# Altium project lab_1.PrjPcb
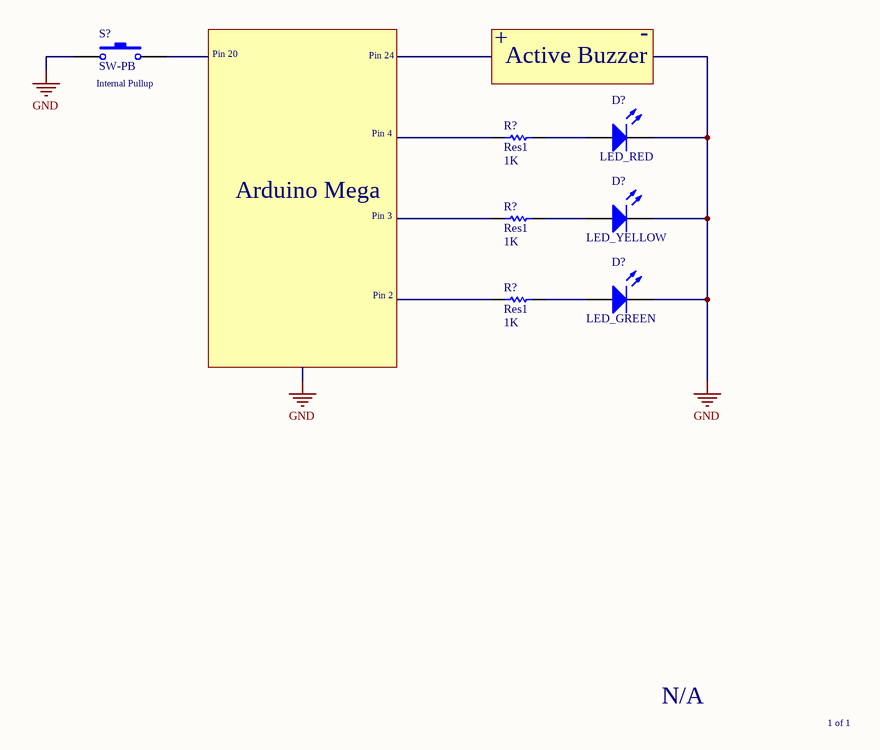
[diagram p0: Sheet1.SchDoc]
1 sheet, 7 parts. Net scope: global (net labels, ports and power ports of the same name join across sheets).

## Sheet Sheet1.SchDoc: Lab 1 Schematic
size A; Author: P. Hoey, R. Dunn, P. Lynch; DocumentNumber: N/A; Revision: A; SheetNumber: 1; SheetTotal: 1

### Parts
(Parts that share a designator on the sheet are numbered #1, #2 ... from top to bottom, then left to right.)
D?#1  LED_RED  [LED-1]
D?#2  LED_YELLOW  [LED-1]
D?#3  LED_GREEN  [LED-1]
R?#1  Res1  value 1K  [AXIAL-0.3]
R?#2  Res1  value 1K  [AXIAL-0.3]
R?#3  Res1  value 1K  [AXIAL-0.3]
S?  SW-PB  [SPST-2]

### Nets
GND: D?#1.2(K) D?#2.2(K) D?#3.2(K) S?.1
NetD?#1_1: D?#1.1(A) R?#1.2
NetD?#2_1: D?#2.1(A) R?#2.2
NetD?#3_1: D?#3.1(A) R?#3.2

Not connected (* = marked no-connect by the designer): R?#1 1; R?#2 1; R?#3 1; S? 2

### Notes on the sheet
- Pin 20
- Pin 24
- +
- -
- (near S?) Internal Pullup
- Active Buzzer
- Pin 4
- Arduino Mega
- Pin 3
- Pin 2
- N/A
- 1 of 1

### Library data of the parts
D?#1-D?#3 = LED1: Typical RED GaAs LED; Published: 8-Jun-2000; LatestRevisionDate: 08-Jul-2005; LatestRevisionNote: Mech Layer 1 removed.; PackageReference: LED-1; Publisher: Altium Limited; PackageDescription: LED; 2 Leads
R?#1-R?#3 = Res1: Resistor; Published: 8-Jun-2000; LatestRevisionDate: 17-Jul-2002; LatestRevisionNote: Re-released for DXP Platform.; PackageReference: AXIAL-0.3; Publisher: Altium Limited; PackageDescription: Axial Device, Thru-Hole; 2 Leads; 0.3 in Pin Spacing
S? = SW-PB: Switch; Published: 24-Mar-1999; LatestRevisionDate: 17-Jul-2002; LatestRevisionNote: Re-released for DXP Platform.; PackageReference: SPST-2; Publisher: Altium Limited; PackageDescription: Switch; 2 Leads